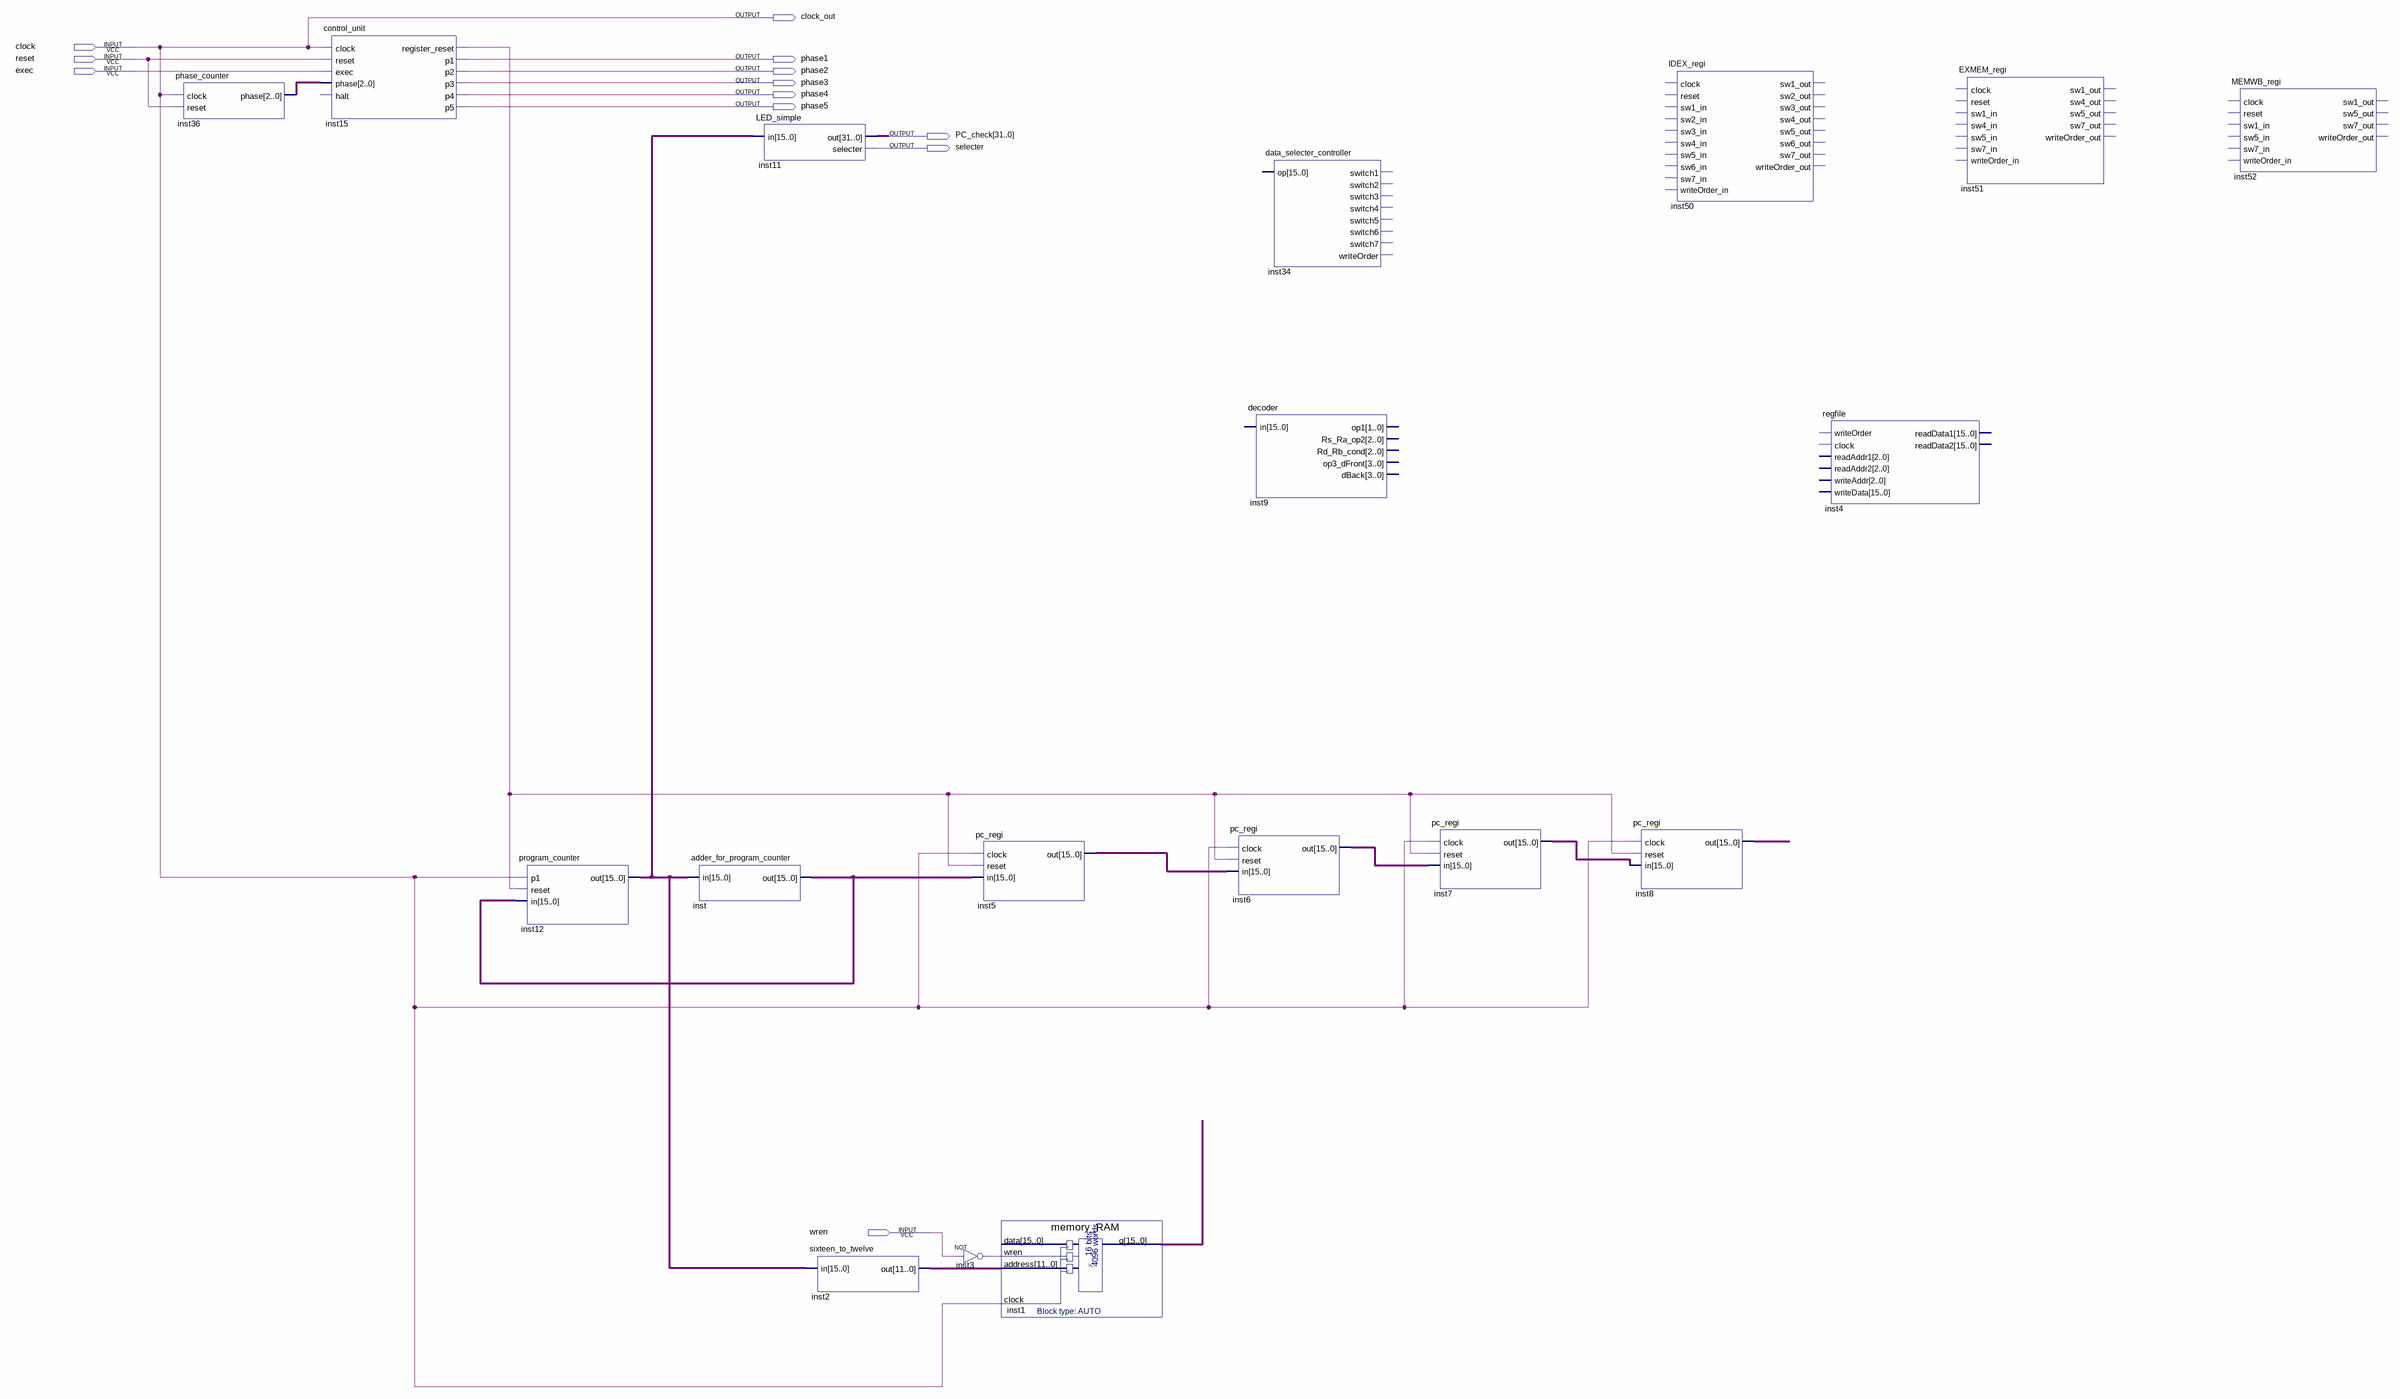
[diagram p0: schematic sheet]
// Quartus schematic processor_test.bdf as structural Verilog: 18 symbols, 12 pins
module processor_test (
  input  clock,
  input  reset,
  input  exec,
  input  wren,
  output clock_out,
  output phase1,
  output phase2,
  output phase3,
  output phase4,
  output phase5,
  output [31:0] PC_check,
  output selecter
);

  wire inst3_out, inst15_register_reset;
  wire [2:0] inst36_phase;
  wire [11:0] inst2_out;
  wire [15:0] inst1_q, inst5_out, inst6_out, inst7_out, inst8_out, inst12_out, inst_out;

  phase_counter inst36 (.clock(clock), .reset(reset), .phase(inst36_phase));
  control_unit inst15 (
    .clock(clock), .reset(reset), .exec(exec), .phase(inst36_phase), .register_reset(inst15_register_reset),
    .p1(phase1), .p2(phase2), .p3(phase3), .p4(phase4), .p5(phase5));  // open: halt
  program_counter inst12 (.p1(clock), .reset(inst15_register_reset), .in(inst_out), .out(inst12_out));
  adder_for_program_counter inst (.in(inst12_out), .out(inst_out));
  LED_simple inst11 (.in(inst12_out), .out(PC_check), .selecter(selecter));
  sixteen_to_twelve inst2 (.in(inst12_out), .out(inst2_out));
  not inst3 (inst3_out, wren);
  pc_regi inst5 (.clock(clock), .reset(inst15_register_reset), .in(inst_out), .out(inst5_out));
  memory_RAM inst1 (.wren(inst3_out), .address(inst2_out), .clock(clock), .q(inst1_q));  // open: data
  pc_regi inst6 (.clock(clock), .reset(inst15_register_reset), .in(inst5_out), .out(inst6_out));
  data_selecter_controller inst34 ();  // open: op, switch1, switch2, switch3, switch4, switch5, switch6, switch7, writeOrder
  decoder inst9 ();  // open: in, op1, Rs_Ra_op2, Rd_Rb_cond, op3_dFront, dBack
  pc_regi inst7 (.clock(clock), .reset(inst15_register_reset), .in(inst6_out), .out(inst7_out));
  IDEX_regi inst50 ();  // open: clock, reset, sw1_in, sw2_in, sw3_in, sw4_in, sw5_in, sw6_in, sw7_in, writeOrder_in, sw1_out, sw2_out, sw3_out, sw4_out, sw5_out, sw6_out, sw7_out, writeOrder_out
  pc_regi inst8 (.clock(clock), .reset(inst15_register_reset), .in(inst7_out), .out(inst8_out));
  regfile inst4 ();  // open: writeOrder, clock, readAddr1, readAddr2, writeAddr, writeData, readData1, readData2
  EXMEM_regi inst51 ();  // open: clock, reset, sw1_in, sw4_in, sw5_in, sw7_in, writeOrder_in, sw1_out, sw4_out, sw5_out, sw7_out, writeOrder_out
  MEMWB_regi inst52 ();  // open: clock, reset, sw1_in, sw5_in, sw7_in, writeOrder_in, sw1_out, sw5_out, sw7_out, writeOrder_out

  assign clock_out = clock;
endmodule
